# EasyEDA schematic SCH_clavier_2026-02-09.json
TITLE: Sheet_1; REV: 1.0; Date: 2026-01-06; Sheet: 1/1; Drawn By: ludoguillain; Company: Your Company
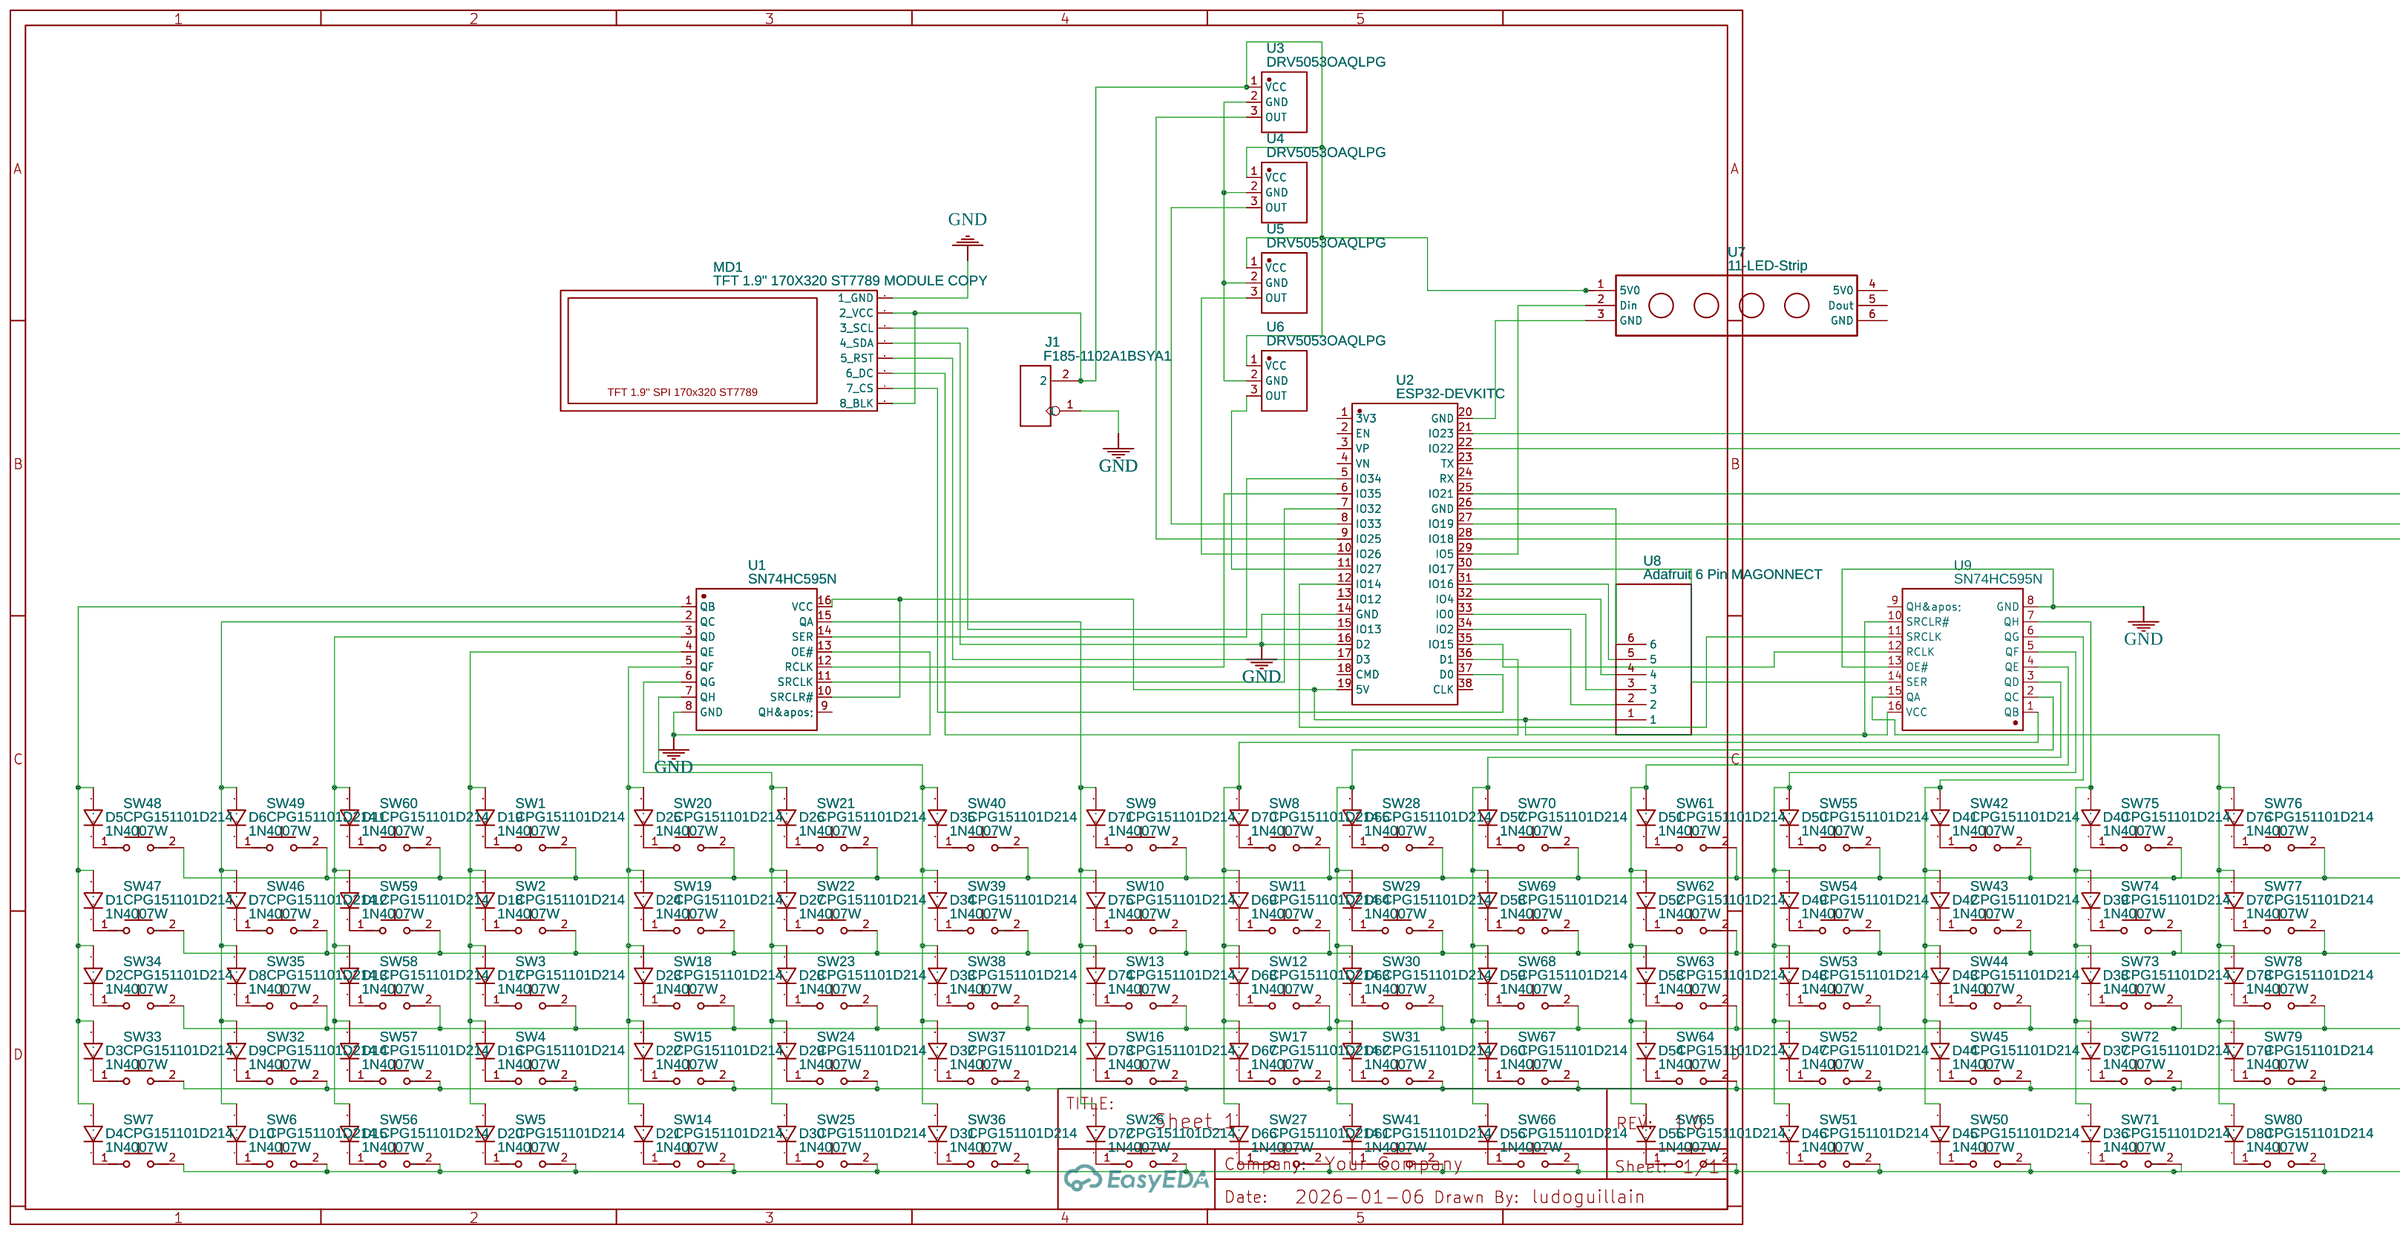
[diagram p0: schematic sheet]

## Parts
D1  1N4007W  [SOD-123_L2.8-W1.8-LS3.7-RD]
D2  1N4007W  [SOD-123_L2.8-W1.8-LS3.7-RD]
D3  1N4007W  [SOD-123_L2.8-W1.8-LS3.7-RD]
D4  1N4007W  [SOD-123_L2.8-W1.8-LS3.7-RD]
D5  1N4007W  [SOD-123_L2.8-W1.8-LS3.7-RD]
D6  1N4007W  [SOD-123_L2.8-W1.8-LS3.7-RD]
D7  1N4007W  [SOD-123_L2.8-W1.8-LS3.7-RD]
D8  1N4007W  [SOD-123_L2.8-W1.8-LS3.7-RD]
D9  1N4007W  [SOD-123_L2.8-W1.8-LS3.7-RD]
D10  1N4007W  [SOD-123_L2.8-W1.8-LS3.7-RD]
D11  1N4007W  [SOD-123_L2.8-W1.8-LS3.7-RD]
D12  1N4007W  [SOD-123_L2.8-W1.8-LS3.7-RD]
D13  1N4007W  [SOD-123_L2.8-W1.8-LS3.7-RD]
D14  1N4007W  [SOD-123_L2.8-W1.8-LS3.7-RD]
D15  1N4007W  [SOD-123_L2.8-W1.8-LS3.7-RD]
D16  1N4007W  [SOD-123_L2.8-W1.8-LS3.7-RD]
D17  1N4007W  [SOD-123_L2.8-W1.8-LS3.7-RD]
D18  1N4007W  [SOD-123_L2.8-W1.8-LS3.7-RD]
D19  1N4007W  [SOD-123_L2.8-W1.8-LS3.7-RD]
D20  1N4007W  [SOD-123_L2.8-W1.8-LS3.7-RD]
D21  1N4007W  [SOD-123_L2.8-W1.8-LS3.7-RD]
D22  1N4007W  [SOD-123_L2.8-W1.8-LS3.7-RD]
D23  1N4007W  [SOD-123_L2.8-W1.8-LS3.7-RD]
D24  1N4007W  [SOD-123_L2.8-W1.8-LS3.7-RD]
D25  1N4007W  [SOD-123_L2.8-W1.8-LS3.7-RD]
D26  1N4007W  [SOD-123_L2.8-W1.8-LS3.7-RD]
D27  1N4007W  [SOD-123_L2.8-W1.8-LS3.7-RD]
D28  1N4007W  [SOD-123_L2.8-W1.8-LS3.7-RD]
D29  1N4007W  [SOD-123_L2.8-W1.8-LS3.7-RD]
D30  1N4007W  [SOD-123_L2.8-W1.8-LS3.7-RD]
D31  1N4007W  [SOD-123_L2.8-W1.8-LS3.7-RD]
D32  1N4007W  [SOD-123_L2.8-W1.8-LS3.7-RD]
D33  1N4007W  [SOD-123_L2.8-W1.8-LS3.7-RD]
D34  1N4007W  [SOD-123_L2.8-W1.8-LS3.7-RD]
D35  1N4007W  [SOD-123_L2.8-W1.8-LS3.7-RD]
D36  1N4007W  [SOD-123_L2.8-W1.8-LS3.7-RD]
D37  1N4007W  [SOD-123_L2.8-W1.8-LS3.7-RD]
D38  1N4007W  [SOD-123_L2.8-W1.8-LS3.7-RD]
D39  1N4007W  [SOD-123_L2.8-W1.8-LS3.7-RD]
D40  1N4007W  [SOD-123_L2.8-W1.8-LS3.7-RD]
D41  1N4007W  [SOD-123_L2.8-W1.8-LS3.7-RD]
D42  1N4007W  [SOD-123_L2.8-W1.8-LS3.7-RD]
D43  1N4007W  [SOD-123_L2.8-W1.8-LS3.7-RD]
D44  1N4007W  [SOD-123_L2.8-W1.8-LS3.7-RD]
D45  1N4007W  [SOD-123_L2.8-W1.8-LS3.7-RD]
D46  1N4007W  [SOD-123_L2.8-W1.8-LS3.7-RD]
D47  1N4007W  [SOD-123_L2.8-W1.8-LS3.7-RD]
D48  1N4007W  [SOD-123_L2.8-W1.8-LS3.7-RD]
D49  1N4007W  [SOD-123_L2.8-W1.8-LS3.7-RD]
D50  1N4007W  [SOD-123_L2.8-W1.8-LS3.7-RD]
D51  1N4007W  [SOD-123_L2.8-W1.8-LS3.7-RD]
D52  1N4007W  [SOD-123_L2.8-W1.8-LS3.7-RD]
D53  1N4007W  [SOD-123_L2.8-W1.8-LS3.7-RD]
D54  1N4007W  [SOD-123_L2.8-W1.8-LS3.7-RD]
D55  1N4007W  [SOD-123_L2.8-W1.8-LS3.7-RD]
D56  1N4007W  [SOD-123_L2.8-W1.8-LS3.7-RD]
D57  1N4007W  [SOD-123_L2.8-W1.8-LS3.7-RD]
D58  1N4007W  [SOD-123_L2.8-W1.8-LS3.7-RD]
D59  1N4007W  [SOD-123_L2.8-W1.8-LS3.7-RD]
D60  1N4007W  [SOD-123_L2.8-W1.8-LS3.7-RD]
D61  1N4007W  [SOD-123_L2.8-W1.8-LS3.7-RD]
D62  1N4007W  [SOD-123_L2.8-W1.8-LS3.7-RD]
D63  1N4007W  [SOD-123_L2.8-W1.8-LS3.7-RD]
D64  1N4007W  [SOD-123_L2.8-W1.8-LS3.7-RD]
D65  1N4007W  [SOD-123_L2.8-W1.8-LS3.7-RD]
D66  1N4007W  [SOD-123_L2.8-W1.8-LS3.7-RD]
D67  1N4007W  [SOD-123_L2.8-W1.8-LS3.7-RD]
D68  1N4007W  [SOD-123_L2.8-W1.8-LS3.7-RD]
D69  1N4007W  [SOD-123_L2.8-W1.8-LS3.7-RD]
D70  1N4007W  [SOD-123_L2.8-W1.8-LS3.7-RD]
D71  1N4007W  [SOD-123_L2.8-W1.8-LS3.7-RD]
D72  1N4007W  [SOD-123_L2.8-W1.8-LS3.7-RD]
D73  1N4007W  [SOD-123_L2.8-W1.8-LS3.7-RD]
D74  1N4007W  [SOD-123_L2.8-W1.8-LS3.7-RD]
D75  1N4007W  [SOD-123_L2.8-W1.8-LS3.7-RD]
D76  1N4007W  [SOD-123_L2.8-W1.8-LS3.7-RD]
D77  1N4007W  [SOD-123_L2.8-W1.8-LS3.7-RD]
D78  1N4007W  [SOD-123_L2.8-W1.8-LS3.7-RD]
D79  1N4007W  [SOD-123_L2.8-W1.8-LS3.7-RD]
D80  1N4007W  [SOD-123_L2.8-W1.8-LS3.7-RD]
J1  F185-1102A1BSYA1  [H2-2.54]
MD1  TFT 1.9" 170X320 ST7789 MODULE COPY  [TFT_170X320_ ST7789_1_9]
SW1  CPG151101D214  [KEY-TH_CPG151101D21X]
SW2  CPG151101D214  [KEY-TH_CPG151101D21X]
SW3  CPG151101D214  [KEY-TH_CPG151101D21X]
SW4  CPG151101D214  [KEY-TH_CPG151101D21X]
SW5  CPG151101D214  [KEY-TH_CPG151101D21X]
SW6  CPG151101D214  [KEY-TH_CPG151101D21X]
SW7  CPG151101D214  [KEY-TH_CPG151101D21X]
SW8  CPG151101D214  [KEY-TH_CPG151101D21X]
SW9  CPG151101D214  [KEY-TH_CPG151101D21X]
SW10  CPG151101D214  [KEY-TH_CPG151101D21X]
SW11  CPG151101D214  [KEY-TH_CPG151101D21X]
SW12  CPG151101D214  [KEY-TH_CPG151101D21X]
SW13  CPG151101D214  [KEY-TH_CPG151101D21X]
SW14  CPG151101D214  [KEY-TH_CPG151101D21X]
SW15  CPG151101D214  [KEY-TH_CPG151101D21X]
SW16  CPG151101D214  [KEY-TH_CPG151101D21X]
SW17  CPG151101D214  [KEY-TH_CPG151101D21X]
SW18  CPG151101D214  [KEY-TH_CPG151101D21X]
SW19  CPG151101D214  [KEY-TH_CPG151101D21X]
SW20  CPG151101D214  [KEY-TH_CPG151101D21X]
SW21  CPG151101D214  [KEY-TH_CPG151101D21X]
SW22  CPG151101D214  [KEY-TH_CPG151101D21X]
SW23  CPG151101D214  [KEY-TH_CPG151101D21X]
SW24  CPG151101D214  [KEY-TH_CPG151101D21X]
SW25  CPG151101D214  [KEY-TH_CPG151101D21X]
SW26  CPG151101D214  [KEY-TH_CPG151101D21X]
SW27  CPG151101D214  [KEY-TH_CPG151101D21X]
SW28  CPG151101D214  [KEY-TH_CPG151101D21X]
SW29  CPG151101D214  [KEY-TH_CPG151101D21X]
SW30  CPG151101D214  [KEY-TH_CPG151101D21X]
SW31  CPG151101D214  [KEY-TH_CPG151101D21X]
SW32  CPG151101D214  [KEY-TH_CPG151101D21X]
SW33  CPG151101D214  [KEY-TH_CPG151101D21X]
SW34  CPG151101D214  [KEY-TH_CPG151101D21X]
SW35  CPG151101D214  [KEY-TH_CPG151101D21X]
SW36  CPG151101D214  [KEY-TH_CPG151101D21X]
SW37  CPG151101D214  [KEY-TH_CPG151101D21X]
SW38  CPG151101D214  [KEY-TH_CPG151101D21X]
SW39  CPG151101D214  [KEY-TH_CPG151101D21X]
SW40  CPG151101D214  [KEY-TH_CPG151101D21X]
SW41  CPG151101D214  [KEY-TH_CPG151101D21X]
SW42  CPG151101D214  [KEY-TH_CPG151101D21X]
SW43  CPG151101D214  [KEY-TH_CPG151101D21X]
SW44  CPG151101D214  [KEY-TH_CPG151101D21X]
SW45  CPG151101D214  [KEY-TH_CPG151101D21X]
SW46  CPG151101D214  [KEY-TH_CPG151101D21X]
SW47  CPG151101D214  [KEY-TH_CPG151101D21X]
SW48  CPG151101D214  [KEY-TH_CPG151101D21X]
SW49  CPG151101D214  [KEY-TH_CPG151101D21X]
SW50  CPG151101D214  [KEY-TH_CPG151101D21X]
SW51  CPG151101D214  [KEY-TH_CPG151101D21X]
SW52  CPG151101D214  [KEY-TH_CPG151101D21X]
SW53  CPG151101D214  [KEY-TH_CPG151101D21X]
SW54  CPG151101D214  [KEY-TH_CPG151101D21X]
SW55  CPG151101D214  [KEY-TH_CPG151101D21X]
SW56  CPG151101D214  [KEY-TH_CPG151101D21X]
SW57  CPG151101D214  [KEY-TH_CPG151101D21X]
SW58  CPG151101D214  [KEY-TH_CPG151101D21X]
SW59  CPG151101D214  [KEY-TH_CPG151101D21X]
SW60  CPG151101D214  [KEY-TH_CPG151101D21X]
SW61  CPG151101D214  [KEY-TH_CPG151101D21X]
SW62  CPG151101D214  [KEY-TH_CPG151101D21X]
SW63  CPG151101D214  [KEY-TH_CPG151101D21X]
SW64  CPG151101D214  [KEY-TH_CPG151101D21X]
SW65  CPG151101D214  [KEY-TH_CPG151101D21X]
SW66  CPG151101D214  [KEY-TH_CPG151101D21X]
SW67  CPG151101D214  [KEY-TH_CPG151101D21X]
SW68  CPG151101D214  [KEY-TH_CPG151101D21X]
SW69  CPG151101D214  [KEY-TH_CPG151101D21X]
SW70  CPG151101D214  [KEY-TH_CPG151101D21X]
SW71  CPG151101D214  [KEY-TH_CPG151101D21X]
SW72  CPG151101D214  [KEY-TH_CPG151101D21X]
SW73  CPG151101D214  [KEY-TH_CPG151101D21X]
SW74  CPG151101D214  [KEY-TH_CPG151101D21X]
SW75  CPG151101D214  [KEY-TH_CPG151101D21X]
SW76  CPG151101D214  [KEY-TH_CPG151101D21X]
SW77  CPG151101D214  [KEY-TH_CPG151101D21X]
SW78  CPG151101D214  [KEY-TH_CPG151101D21X]
SW79  CPG151101D214  [KEY-TH_CPG151101D21X]
SW80  CPG151101D214  [KEY-TH_CPG151101D21X]
U1  SN74HC595N  [DIP-16_L19.8-W6.5-P2.54-LS7.6-BL]
U2  ESP32-DEVKITC  [BULETM-SMD_ESP32-DEVKITC]
U3  DRV5053OAQLPG  [TO-92-3_L4.1-W1.6-P1.27-L]
U4  DRV5053OAQLPG  [TO-92-3_L4.1-W1.6-P1.27-L]
U5  DRV5053OAQLPG  [TO-92-3_L4.1-W1.6-P1.27-L]
U6  DRV5053OAQLPG  [TO-92-3_L4.1-W1.6-P1.27-L]
U7  11-LED-Strip  [11-LED-STRIP]
U8  Adafruit 6 Pin MAGONNECT  [MAGNETIC CONNECTOR 9PIN]
U9  SN74HC595N  [DIP-16_L19.8-W6.5-P2.54-LS7.6-BL]

## Library data of the parts
D1-D80 = 1N4007W: Supplier: LCSC; Supplier Part: C328592; Manufacturer: BLUE ROCKET; Contributor: LCEDA_Lib
J1 = F185-1102A1BSYA1: DIP Black Female Header VERT;
MD1 = TFT 1.9" 170X320 ST7789 MODULE COPY: Contributor: cabreani
SW1-SW80 = CPG151101D214: Contributor: LCSC; Supplier: LCSC; Supplier Part: C400232; Manufacturer: Kailh(凯华); JLCPCB Part Class: Extended Part
U1 U9 = SN74HC595N: Supplier: LCSC; Manufacturer: TI(德州仪器); Supplier Part: C78711; JLCPCB Part Class: Extended Part
U2 = ESP32-DEVKITC: Supplier: LCSC; Supplier Part: C571180; Manufacturer: ESPRESSIF(乐鑫); Manufacturer Part: ESP32-DevKitC; Contributor: lcsc
U3-U6 = DRV5053OAQLPG: Supplier: LCSC; Supplier Part: C1526566; Manufacturer: TI(德州仪器); JLCPCB Part Class: Extended Part; Contributor: lcsc
U7 = 11-LED-Strip: Contributor: rafelord4
U8 = Adafruit 6 Pin MAGONNECT: Contributor: rmccullough3000

## Nets
GND: J1.1 MD1.1(1 GND) MD1.4(4 SDA) U1.8(GND) U1.13(OE#) U2.14(GND) U2.16(D2) U9.8(GND) U9.13(OE#)
Net-(D1-1): D1.1 SW47.1
Net-(D1-2): D1.2 D2.2 D3.2 D4.2 D5.2 U1.1(QB)
Net-(D2-1): D2.1 SW34.1
Net-(D3-1): D3.1 SW33.1
Net-(D4-1): D4.1 SW7.1
Net-(D5-1): D5.1 SW48.1
Net-(D6-1): D6.1 SW49.1
Net-(D6-2): D6.2 D7.2 D8.2 D9.2 D10.2 U1.2(QC)
Net-(D7-1): D7.1 SW46.1
Net-(D8-1): D8.1 SW35.1
Net-(D9-1): D9.1 SW32.1
Net-(D10-1): D10.1 SW6.1
Net-(D11-1): D11.1 SW60.1
Net-(D11-2): D11.2 D12.2 D13.2 D14.2 D15.2 U1.3(QD)
Net-(D12-1): D12.1 SW59.1
Net-(D13-1): D13.1 SW58.1
Net-(D14-1): D14.1 SW57.1
Net-(D15-1): D15.1 SW56.1
Net-(D16-1): D16.1 SW4.1
Net-(D16-2): D16.2 D17.2 D18.2 D19.2 D20.2 U1.4(QE)
Net-(D17-1): D17.1 SW3.1
Net-(D18-1): D18.1 SW2.1
Net-(D19-1): D19.1 SW1.1
Net-(D20-1): D20.1 SW5.1
Net-(D21-1): D21.1 SW14.1
Net-(D21-2): D21.2 D22.2 D23.2 D24.2 D25.2 U1.5(QF)
Net-(D22-1): D22.1 SW15.1
Net-(D23-1): D23.1 SW18.1
Net-(D24-1): D24.1 SW19.1
Net-(D25-1): D25.1 SW20.1
Net-(D26-1): D26.1 SW21.1
Net-(D26-2): D26.2 D27.2 D28.2 D29.2 D30.2 U1.6(QG)
Net-(D27-1): D27.1 SW22.1
Net-(D28-1): D28.1 SW23.1
Net-(D29-1): D29.1 SW24.1
Net-(D30-1): D30.1 SW25.1
Net-(D31-1): D31.1 SW36.1
Net-(D31-2): D31.2 D32.2 D33.2 D34.2 D35.2 U1.7(QH)
Net-(D32-1): D32.1 SW37.1
Net-(D33-1): D33.1 SW38.1
Net-(D34-1): D34.1 SW39.1
Net-(D35-1): D35.1 SW40.1
Net-(D36-1): D36.1 SW71.1
Net-(D36-2): D36.2 D37.2 D38.2 D39.2 D40.2 U9.7(QH)
Net-(D37-1): D37.1 SW72.1
Net-(D38-1): D38.1 SW73.1
Net-(D39-1): D39.1 SW74.1
Net-(D40-1): D40.1 SW75.1
Net-(D41-1): D41.1 SW42.1
Net-(D41-2): D41.2 D42.2 D43.2 D44.2 D45.2 U9.6(QG)
Net-(D42-1): D42.1 SW43.1
Net-(D43-1): D43.1 SW44.1
Net-(D44-1): D44.1 SW45.1
Net-(D45-1): D45.1 SW50.1
Net-(D46-1): D46.1 SW51.1
Net-(D46-2): D46.2 D47.2 D48.2 D49.2 D50.2 U9.5(QF)
Net-(D47-1): D47.1 SW52.1
Net-(D48-1): D48.1 SW53.1
Net-(D49-1): D49.1 SW54.1
Net-(D50-1): D50.1 SW55.1
Net-(D51-1): D51.1 SW61.1
Net-(D51-2): D51.2 D52.2 D53.2 D54.2 D55.2 U9.4(QE)
Net-(D52-1): D52.1 SW62.1
Net-(D53-1): D53.1 SW63.1
Net-(D54-1): D54.1 SW64.1
Net-(D55-1): D55.1 SW65.1
Net-(D56-1): D56.1 SW66.1
Net-(D56-2): D56.2 D57.2 D58.2 D59.2 D60.2 U9.3(QD)
Net-(D57-1): D57.1 SW70.1
Net-(D58-1): D58.1 SW69.1
Net-(D59-1): D59.1 SW68.1
Net-(D60-1): D60.1 SW67.1
Net-(D61-1): D61.1 SW41.1
Net-(D61-2): D61.2 D62.2 D63.2 D64.2 D65.2 U9.2(QC)
Net-(D62-1): D62.1 SW31.1
Net-(D63-1): D63.1 SW30.1
Net-(D64-1): D64.1 SW29.1
Net-(D65-1): D65.1 SW28.1
Net-(D66-1): D66.1 SW27.1
Net-(D66-2): D66.2 D67.2 D68.2 D69.2 D70.2 U9.1(QB)
Net-(D67-1): D67.1 SW17.1
Net-(D68-1): D68.1 SW12.1
Net-(D69-1): D69.1 SW11.1
Net-(D70-1): D70.1 SW8.1
Net-(D71-1): D71.1 SW9.1
Net-(D71-2): D71.2 D72.2 D73.2 D74.2 D75.2 U1.15(QA)
Net-(D72-1): D72.1 SW26.1
Net-(D73-1): D73.1 SW16.1
Net-(D74-1): D74.1 SW13.1
Net-(D75-1): D75.1 SW10.1
Net-(D76-1): D76.1 SW76.1
Net-(D76-2): D76.2 D77.2 D78.2 D79.2 D80.2 U9.15(QA)
Net-(D77-1): D77.1 SW77.1
Net-(D78-1): D78.1 SW78.1
Net-(D79-1): D79.1 SW79.1
Net-(D80-1): D80.1 SW80.1
Net-(J1-2): J1.2 MD1.2(2 VCC) MD1.8(8 BLK) U3.1(VCC) U4.1(VCC) U5.1(VCC) U6.1(VCC) U7.1(5V0)
Net-(MD1-3): MD1.3(3 SCL) U2.15(IO13)
Net-(MD1-5): MD1.5(5 RST) U2.17(D3)
Net-(MD1-6): MD1.6(6 DC) U2.36(D1)
Net-(MD1-7): MD1.7(7 CS) U2.37(D0)
Net-(SW1-2): SW1.2 SW8.2 SW9.2 SW20.2 SW21.2 SW28.2 SW40.2 SW42.2 SW48.2 SW49.2 SW55.2 SW60.2 SW61.2 SW70.2 SW75.2 SW76.2 U2.25(IO21)
Net-(SW2-2): SW2.2 SW10.2 SW11.2 SW19.2 SW22.2 SW29.2 SW39.2 SW43.2 SW46.2 SW47.2 SW54.2 SW59.2 SW62.2 SW69.2 SW74.2 SW77.2 U2.28(IO18)
Net-(SW3-2): SW3.2 SW12.2 SW13.2 SW18.2 SW23.2 SW30.2 SW34.2 SW35.2 SW38.2 SW44.2 SW53.2 SW58.2 SW63.2 SW68.2 SW73.2 SW78.2 U2.27(IO19)
Net-(SW4-2): SW4.2 SW15.2 SW16.2 SW17.2 SW24.2 SW31.2 SW32.2 SW33.2 SW37.2 SW45.2 SW52.2 SW57.2 SW64.2 SW67.2 SW72.2 SW79.2 U2.22(IO22)
Net-(SW5-2): SW5.2 SW6.2 SW7.2 SW14.2 SW25.2 SW26.2 SW27.2 SW36.2 SW41.2 SW50.2 SW51.2 SW56.2 SW65.2 SW66.2 SW71.2 SW80.2 U2.21(IO23)
Net-(U1-10): U1.10(SRCLR#) U1.16(VCC) U2.19(5V) U8.1 U9.10(SRCLR#) U9.16(VCC)
Net-(U1-11): U1.11(SRCLK) U2.7(IO32)
Net-(U1-12): U1.12(RCLK) U2.6(IO35)
Net-(U1-14): U1.14(SER) U2.5(IO34)
Net-(U2-8): U2.8(IO33) U4.3(OUT)
Net-(U2-9): U2.9(IO25) U3.3(OUT)
Net-(U2-10): U2.10(IO26) U5.3(OUT)
Net-(U2-11): U2.11(IO27) U6.3(OUT)
Net-(U2-12): U2.12(IO14) U9.11(SRCLK)
Net-(U2-20): U2.20(GND) U7.3(GND)
Net-(U2-26): U2.26(GND) U8.6
Net-(U2-29): U2.29(IO5) U7.2(Din)
Net-(U2-30): U2.30(IO17) U9.14(SER)
Net-(U2-31): U2.31(IO16) U8.5
Net-(U2-32): U2.32(IO4) U8.4
Net-(U2-33): U2.33(IO0) U8.3
Net-(U2-34): U2.34(IO2) U8.2
Net-(U2-35): U2.35(IO15) U9.12(RCLK)
Net-(U3-2): U3.2(GND) U4.2(GND) U5.2(GND) U6.2(GND)

Not connected (* = marked no-connect by the designer): U1 9(QH'); U2 1(3V3) 2(EN) 3(VP) 4(VN) 13(IO12) 18(CMD) 23(TX) 24(RX) 38(CLK); U7 4(5V0) 5(Dout) 6(GND); U9 9(QH')
